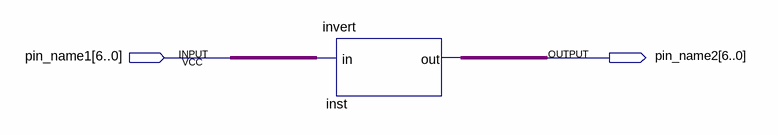
[diagram p0: schematic sheet]
// Quartus schematic invtest.bdf as structural Verilog: 1 symbols, 2 pins
module invtest (
  input  [6:0] pin_name1,
  output [6:0] pin_name2
);

  invert inst (.in(pin_name1), .out(pin_name2));
endmodule
